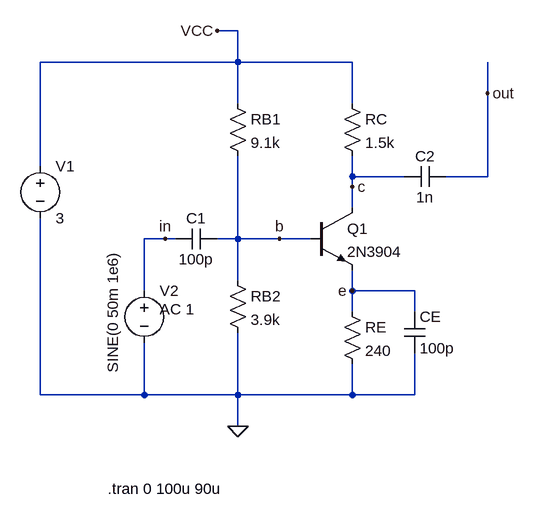
[diagram p0: schematic 01_Bipolar_Biasing_part_10.asc]
01_Bipolar_Biasing_part_10.asc, the LTspice schematic file:
Version 4
SHEET 1 880 816
WIRE 304 96 272 96
WIRE 304 144 304 96
WIRE 304 144 0 144
WIRE 480 144 304 144
WIRE 688 192 688 144
WIRE 304 208 304 144
WIRE 480 208 480 144
WIRE 0 304 0 144
WIRE 480 320 480 288
WIRE 560 320 480 320
WIRE 688 320 688 192
WIRE 688 320 624 320
WIRE 480 336 480 320
WIRE 480 368 480 336
WIRE 192 416 160 416
WIRE 208 416 192 416
WIRE 304 416 304 288
WIRE 304 416 272 416
WIRE 368 416 304 416
WIRE 416 416 368 416
WIRE 304 480 304 416
WIRE 160 496 160 416
WIRE 480 496 480 464
WIRE 576 496 480 496
WIRE 480 528 480 496
WIRE 576 528 576 496
WIRE 0 656 0 384
WIRE 160 656 160 576
WIRE 160 656 0 656
WIRE 304 656 304 560
WIRE 304 656 160 656
WIRE 480 656 480 608
WIRE 480 656 304 656
WIRE 576 656 576 592
WIRE 576 656 480 656
WIRE 304 704 304 656
FLAG 480 336 c
FLAG 304 704 0
FLAG 368 416 b
FLAG 272 96 VCC
FLAG 480 496 e
FLAG 688 192 out
FLAG 192 416 in
SYMBOL voltage 0 288 R0
WINDOW 123 0 0 Left 0
WINDOW 39 0 0 Left 0
SYMATTR InstName V1
SYMATTR Value 3
SYMBOL res 464 192 R0
SYMATTR InstName RC
SYMATTR Value 1.5k
SYMBOL npn 416 368 R0
SYMATTR InstName Q1
SYMATTR Value 2N3904
SYMBOL res 288 192 R0
SYMATTR InstName RB1
SYMATTR Value 9.1k
SYMBOL res 464 512 R0
SYMATTR InstName RE
SYMATTR Value 240
SYMBOL cap 560 528 R0
SYMATTR InstName CE
SYMATTR Value 100p
SYMBOL res 288 464 R0
SYMATTR InstName RB2
SYMATTR Value 3.9k
SYMBOL voltage 160 480 R0
WINDOW 3 -48 -44 VRight 2
WINDOW 123 24 44 Left 2
WINDOW 39 0 0 Left 0
SYMATTR Value SINE(0 50m 1e6)
SYMATTR Value2 AC 1
SYMATTR InstName V2
SYMBOL cap 272 400 R90
WINDOW 0 0 32 VBottom 2
WINDOW 3 32 32 VTop 2
SYMATTR InstName C1
SYMATTR Value 100p
SYMBOL cap 624 304 R90
WINDOW 0 0 32 VBottom 2
WINDOW 3 32 32 VTop 2
SYMATTR InstName C2
SYMATTR Value 1n
TEXT 104 800 Left 2 !.tran 0 100u 90u

The netlist it stands for:
* 01_Bipolar_Biasing_part_10.asc
V1 VCC 0 3
RC VCC c 1.5k
Q1 c b e 0 2N3904
RB1 VCC b 9.1k
RE e 0 240
CE e 0 100p
RB2 b 0 3.9k
V2 in 0 SINE(0 50m 1e6) AC 1
C1 b in 100p
C2 out c 1n
.model NPN NPN
.model PNP PNP
.lib standard.bjt
.tran 0 100u 90u
.backanno
.end